# EAGLE design ble113_shield (EAGLE 7.2.0)
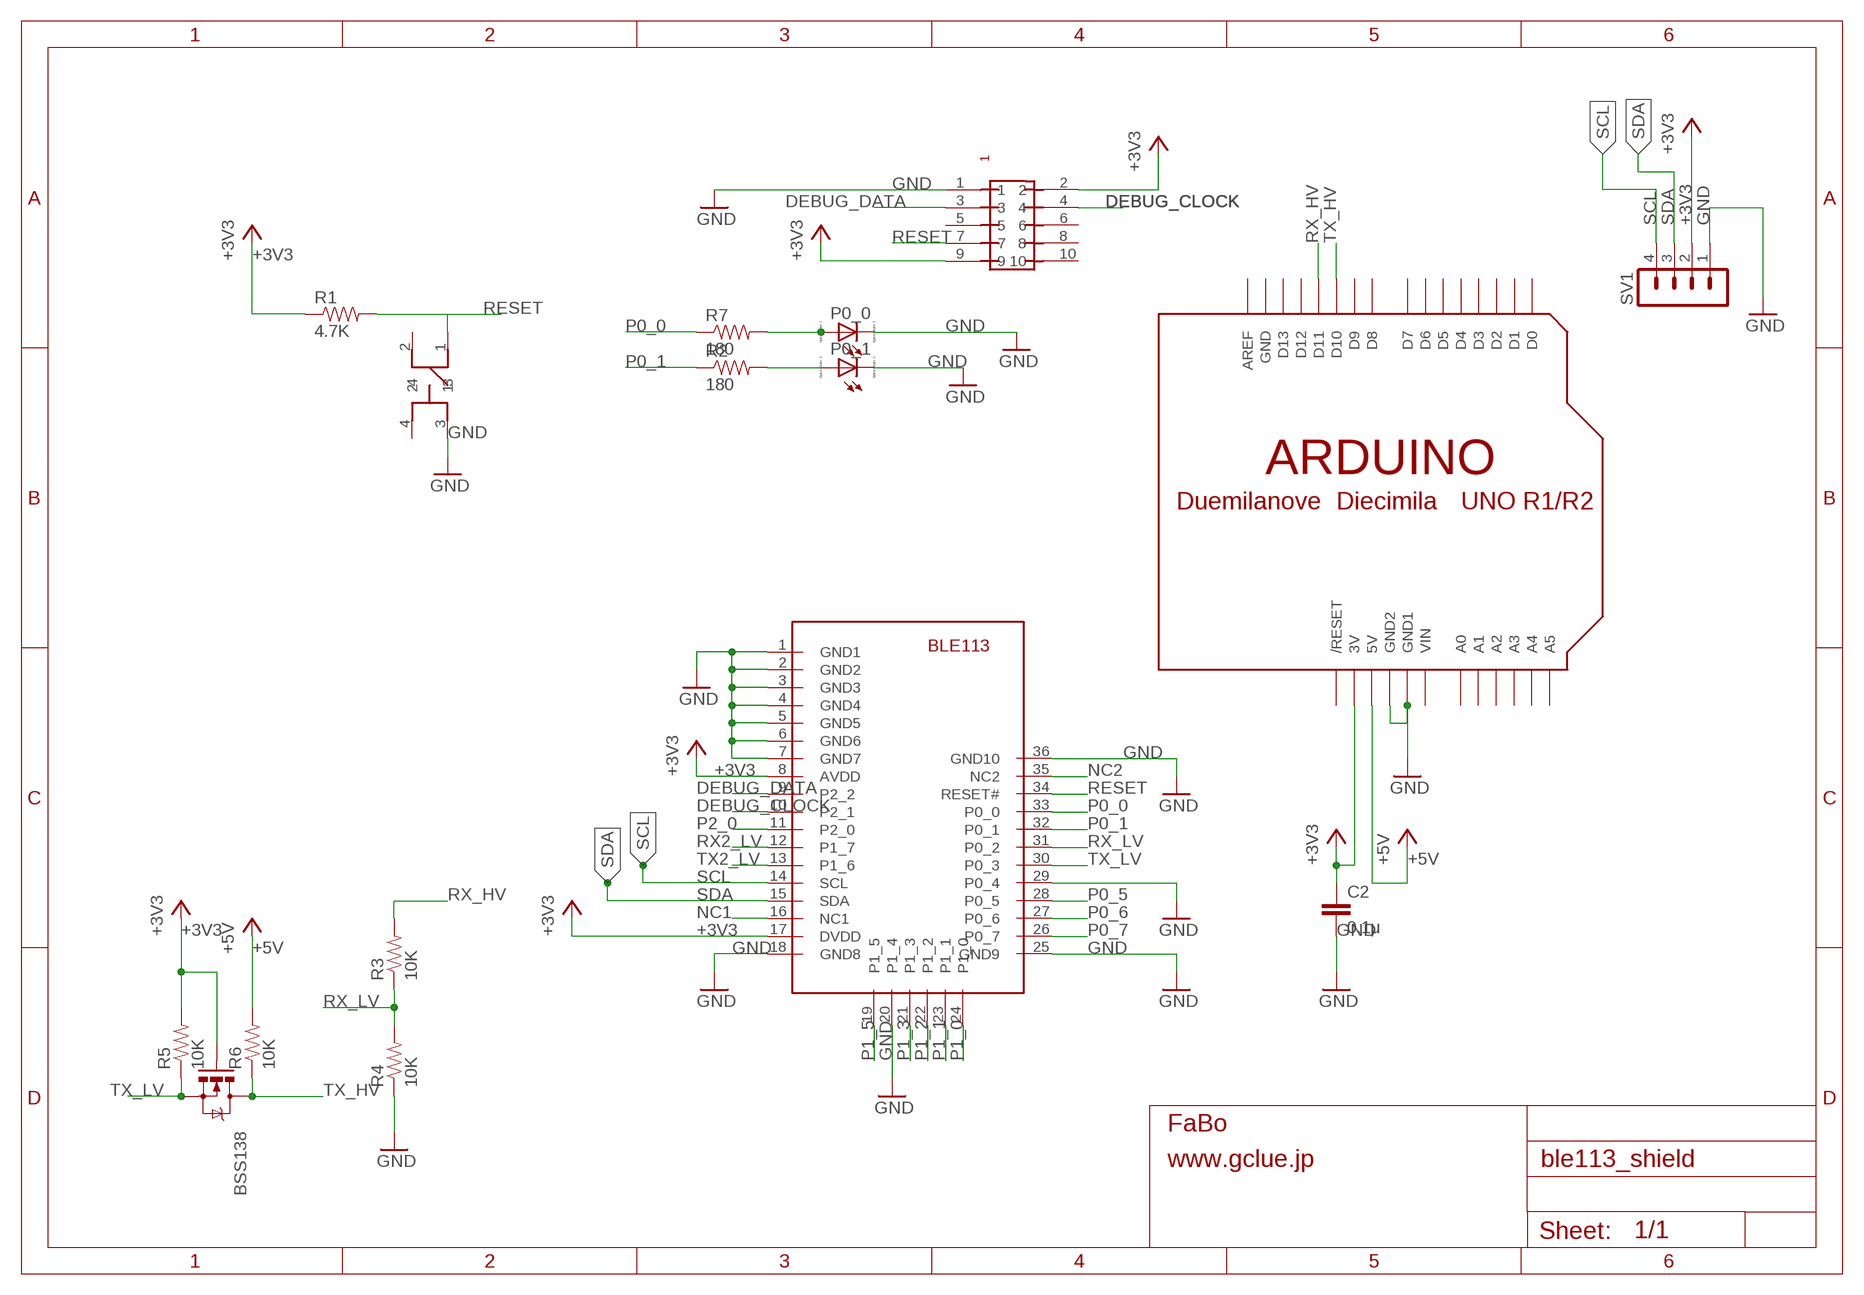
[diagram p0: schematic, sheet 1]

## Parts
BSS138  MOSFET-NCHANNELSMD  [SOT23-3]
C2  0.1μ  CAP0603-CAP  [0603-CAP]
P0_0  LED_ESML0603  [LED_SML0603]
P0_1  LED_ESML0603  [LED_SML0603]
R1  4.7K  RESISTOR0603-RES  [0603-RES]
R2  180  RESISTOR0603-RES  [0603-RES]
R3  10K  RESISTOR0603-RES  [0603-RES]
R4  10K  RESISTOR0603-RES  [0603-RES]
R5  10K  RESISTOR0603-RES  [0603-RES]
R6  10K  RESISTOR0603-RES  [0603-RES]
R7  180  RESISTOR0603-RES  [0603-RES]
SV1  MA04-1  [MA04-1]
U$1  PIN-HEADER-SMT(1.27MM)2X5  [PIN-HEADER-SMT(1.27MM)2X5]
U$4  SWITCH-LS6J2M-T  [SWICTH-LS6J2M-T]
U$6  BLUEGIGA-BLE113  [BLUEGIGA-BLE113]
U$7  ARDUINOUNO  [ARDUINO]

## Nets
+3V3: BSS138.1(G) C2.1 R1.1 R5.2 SV1.2 U$1.2 U$1.9 U$6.8(AVDD) U$6.17(DVDD) U$7.3V
+5V: R6.2 U$7.5V
DEBUG_CLOCK: U$1.4 U$6.10(P2_1)
DEBUG_DATA: U$1.3 U$6.9(P2_2)
GND: C2.2 P0_0.C P0_1.C R4.1 SV1.1 U$1.1 U$4.3 U$6.1(GND1) U$6.2(GND2) U$6.3(GND3) U$6.4(GND4) U$6.5(GND5) U$6.6(GND6) U$6.7(GND7) U$6.18(GND8) U$6.20(P1_4) U$6.25(GND9) U$6.29(P0_4) U$6.36(GND10) U$7.GND1 U$7.GND2
N$1: P0_0.A R7.2
N$2: P0_1.A R2.2
NC1: U$6.16(NC1)
NC2: U$6.35(NC2)
P0_0: R7.1 U$6.33(P0_0)
P0_1: R2.1 U$6.32(P0_1)
P0_5: U$6.28(P0_5)
P0_6: U$6.27(P0_6)
P0_7: U$6.26(P0_7)
P1_0: U$6.24(P1_0)
P1_1: U$6.23(P1_1)
P1_2: U$6.22(P1_2)
P1_3: U$6.21(P1_3)
P1_5: U$6.19(P1_5)
P2_0: U$6.11(P2_0)
RESET: R1.2 U$1.7 U$4.1 U$6.34(RESET#)
RX2_LV: U$6.12(P1_7)
RX_HV: R3.2 U$7.D11
RX_LV: R3.1 R4.2 U$6.31(P0_2)
SCL: SV1.4 U$6.14(SCL)
SDA: SV1.3 U$6.15(SDA)
TX2_LV: U$6.13(P1_6)
TX_HV: BSS138.3(D) R6.1 U$7.D10
TX_LV: BSS138.2(S) R5.1 U$6.30(P0_3)
Unconnected: U$1.5 U$1.6 U$1.8 U$1.10 U$4.2 U$4.4 U$7.A0 U$7.A1 U$7.A2 U$7.A3 U$7.A4 U$7.A5 U$7.AREF U$7.D0 U$7.D1 U$7.D2 U$7.D3 U$7.D4 U$7.D5 U$7.D6 U$7.D7 U$7.D8 U$7.D9 U$7.D12 U$7.D13 U$7.RESET(/RESET)

## Power pins joined to a net without a drawn wire
GND: U$7.GND
VIN: U$7.VIN

## Library data of the parts
BSS138 = SparkFun:MOSFET-NCHANNEL
C2 = SparkFun:CAP: Capacitor Standard 0603 ceramic capacitor, and 0.1" leaded capacitor.
P0_0 P0_1 = eagle-ltspice:LED_E: LED Source: http://www.osram.convergy.de Source: www.luxeon.com Source: www.kingbright.com; SPICEMODEL: NONE; SPICEPREFIX: D; SPICETYPE: diode
R1-R7 = SparkFun:RESISTOR: Resistor Basic schematic elements and footprints for 0603, 1206, and PTH resistors.
SV1 = con-lstb:MA04-1: PIN HEADER; OC_FARNELL: unknown; OC_NEWARK: unknown
U$1 = gclue:PIN-HEADER-SMT(1.27MM)2X5: PIN-HEADER-SMT (1.27MM) 2x5
U$4 = gclue:SWITCH-LS6J2M-T
U$6 = gclueBT:BLUEGIGA-BLE113: Bluegiga BLE113 Bluetooth Bluetooth 4.0 low energy radio Radio Transmit power: +0 dBm Receiver sensitivity: -93 dBm Typical line-of-sight range: 30 - 100 meters Current Consumption TX peak current: 18.2 mA, 14.3 ma (with DC/DC) RX peak current: 17.9 mA Power mode 1: 270 uA Power mode 2: 1 uA Power mode 3: 0.4 uA Certifications Japan: MIC Japan( 007-AB0103)
U$7 = adafruit:ARDUINO: Arduino Diecimila/Duemilanove Make a shield with ease, this package has all the named pins as well as the two mounting drill holes and an outline of the USB and DC power connector. The outline is on the DIMENSION layer, so if your board house uses it they will cut the outline to match. http://www.ladyada.net/library/pcb/eaglelibrary.html

## Board
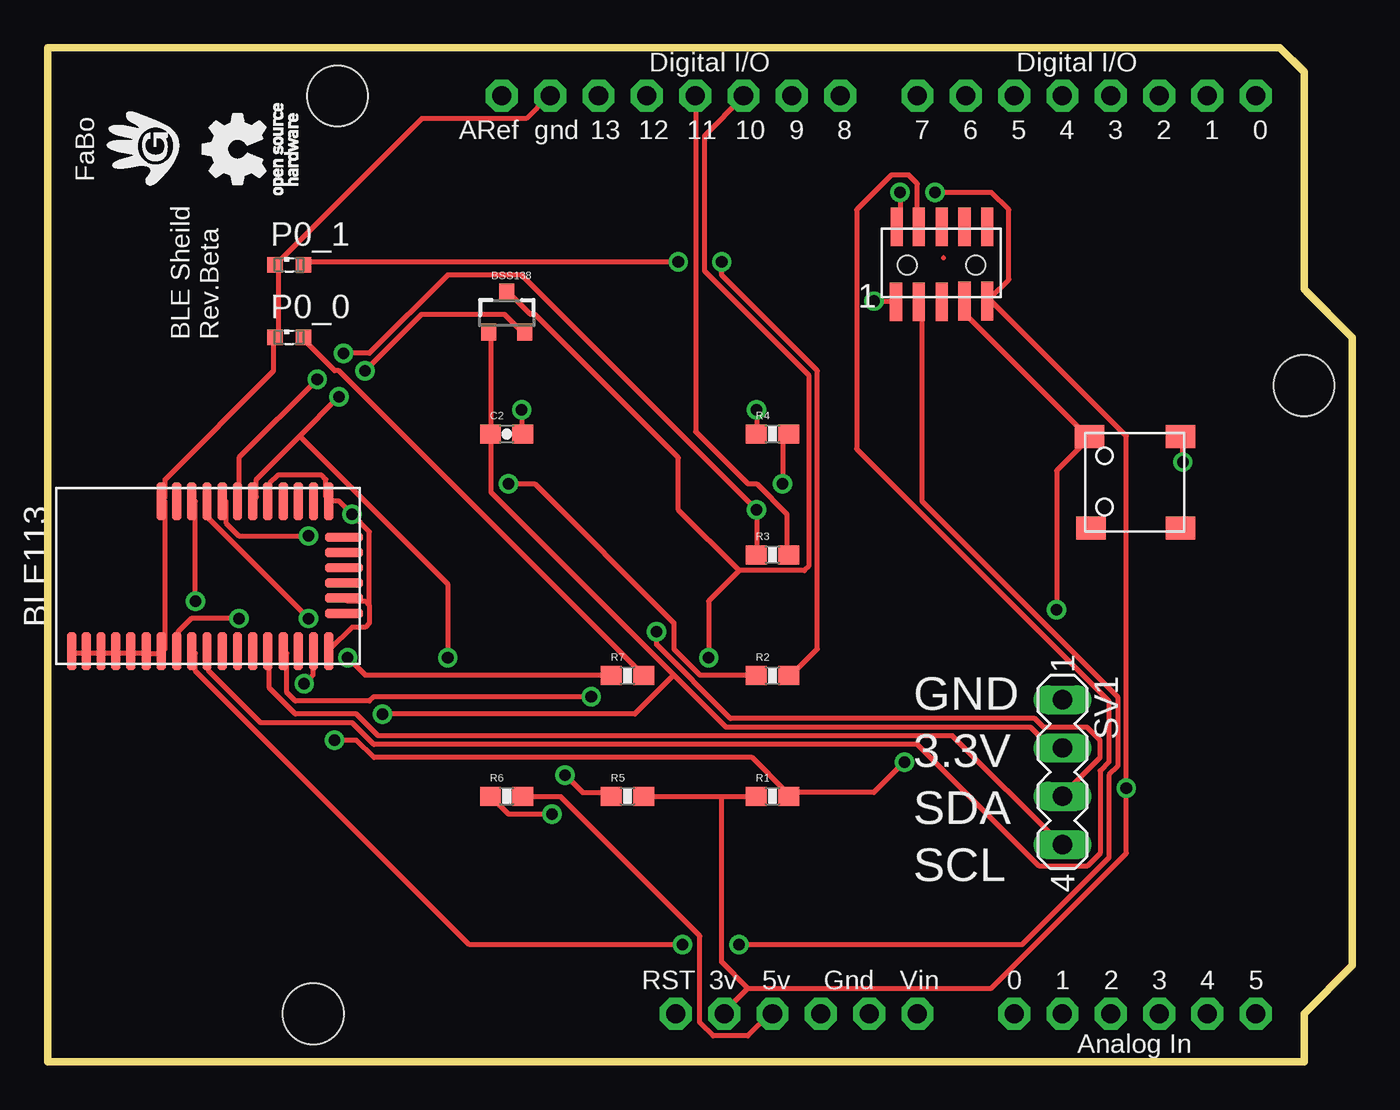
[diagram p1: board, top side]
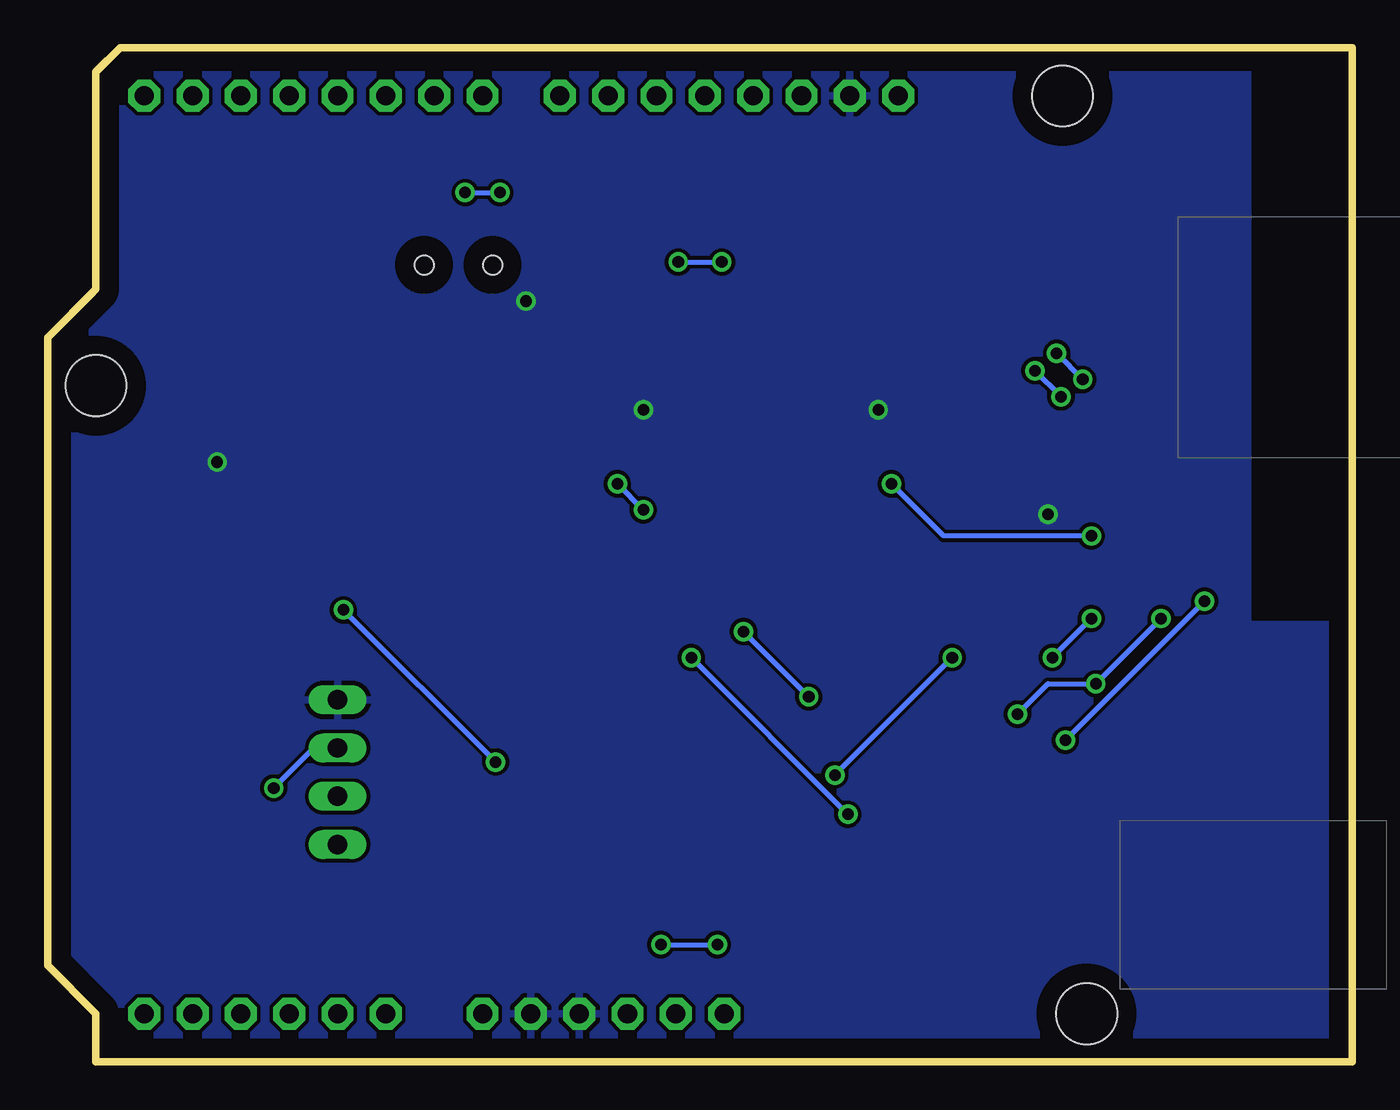
[diagram p2: board, bottom side, seen from below]

Size 68.58 x 53.34 mm. Coordinates in mm from the lower left corner, seen from the top.
Outline: 0,0 66.04,0 66.04,2.54 68.58,5.08 68.58,38.1 66.04,40.64 66.04,52.07 64.77,53.34 0,53.34 0,0
Copper layers (1*16): Top 0.035mm / dielectric 1.5mm / Bottom 0.035mm
Design rules "default": minimum track width 10mil, minimum drill 24mil, track to track 8mil, track to pad 8mil, pad to pad 8mil, via to via 8mil, smd to smd 8mil, copper to edge 40mil, drill to drill 8mil, minimum pad ring 10mil, minimum via ring 8mil, stop-mask expansion 4mil, vias tented up to drill 0mil, thermal gap 10mil
tKeepout: area 0,23 to 5.5,53.3
bKeepout: area 0,23 to 5.5,53.5

### Footprints (pad centres in the part's own frame; a part is rotated, then mirrored left to right if it is on the bottom)
SOT23-3 = smd 0.8 x 0.9: 1 -0.95,-1; 2 0.95,-1; 3 0,1.1
0603-CAP = smd 1.1 x 1: 1 -0.85,0; 2 0.85,0
LED_SML0603 = smd 0.8 x 0.8: A 0.75,0; C -0.75,0
0603-RES = smd 1.1 x 1: 1 -0.85,0; 2 0.85,0
MA04-1 = drill 1.016 long: 1 -3.81,0; 2 -1.27,0; 3 1.27,0; 4 3.81,0
PIN-HEADER-SMT(1.27MM)2X5 = smd 0.635 x 2.032: 1 -2.4,-1.95; 2 -2.35,2; 3 -1.2,-1.95; 4 -1.2,2; 5 0,-1.95; 6 0,2; 7 1.2,-1.9; 8 1.2,2; 9 2.4,-1.9; 10 2.4,2 | hole 1: 1.8,0; -1.8,0
SWICTH-LS6J2M-T = smd 1.55 x 1.2: 1 -2.4,2.4; 2 -2.3,-2.4; 3 2.4,2.4; 4 2.4,-2.4
BLUEGIGA-BLE113 = smd 2 x 0.5: 1 -3.81,6.35; 2 -3.81,5.58; 3 -3.81,4.81; 4 -3.81,4.04; 5 -3.81,3.24; 6 -3.81,2.44; 7 -3.81,1.64; 8 -3.81,0.84; 9 -3.81,0.04; 10 -3.81,-0.76; 11 -3.81,-1.56; 12 -3.81,-2.36; 13 -3.81,-3.16; 14 -3.81,-3.96; 15 -3.81,-4.76; 16 -3.81,-5.56; 17 -3.81,-6.36; 18 -3.81,-7.16; 25 4.09,-7.16; 26 4.09,-6.36; 27 4.09,-5.56; 28 4.09,-4.76; 29 4.09,-3.96; 30 4.09,-3.16; 31 4.09,-2.36; 32 4.09,-1.56; 33 4.09,-0.76; 34 4.09,0.04; 35 4.09,0.84; 36 4.09,1.64 | smd 0.5 x 2: 19 -1.81,-7.96; 20 -1.01,-7.96; 21 -0.21,-7.96; 22 0.59,-7.96; 23 1.39,-7.96; 24 2.19,-7.96
ARDUINO = drill 1 pad 1.676 octagon: 3V 35.56,2.54; 5V 38.1,2.54; A0 50.8,2.54; A1 53.34,2.54; A2 55.88,2.54; A3 58.42,2.54; A4 60.96,2.54; A5 63.5,2.54; AREF 23.876,50.8; D0 63.5,50.8; D1 60.96,50.8; D2 58.42,50.8; D3 55.88,50.8; D4 53.34,50.8; D5 50.8,50.8; D6 48.26,50.8; D7 45.72,50.8; D8 41.656,50.8; D9 39.116,50.8; D10 36.576,50.8; D11 34.036,50.8; D12 31.496,50.8; D13 28.956,50.8; GND 26.416,50.8; GND1 43.18,2.54; GND2 40.64,2.54; RESET 33.02,2.54; VIN 45.72,2.54 | hole 3.2: 15.24,50.8; 66.04,35.56; 13.97,2.54

### Placement (x,y rotation side)
BSS138  24.13,39.37 0 top
C2  24.13,33.02 0 top
P0_0  12.7,38.1 0 top
P0_1  12.7,41.91 0 top
R1  38.1,13.97 0 top
R2  38.1,20.32 0 top
R3  38.1,26.67 0 top
R4  38.1,33.02 0 top
R5  30.48,13.97 0 top
R6  24.13,13.97 0 top
R7  30.48,20.32 0 top
SV1  53.34,15.24 270 top
U$1  46.99,41.91 0 top
U$2  [LOGO_FABO_M]  5,48 90 top
U$3  [LOGO_OSHW_T_M]  10,48 90 top
U$4  57.15,30.48 0 top
U$6  7.62,25.4 90 top
U$7  0,0 0 top

### Tracks (layer width: path | path; a pad name or v marks a point on that pad's centre or on a via)
+3V3  (via drill 0.61)
  Top 0.254: 35.43,13.95 37.03,13.95 R1.1 | 35.43,13.95 31.55,13.95 R5.2 | 36.8,3.89 49.61,3.89 56.69,10.97 v56.69,14.4 56.69,32.92 49.61,40.01 U$1.9 49.61,40.23 50.52,41.15 50.52,44.81 49.61,45.72 v46.63,45.72 | 36.8,3.89 35.66,2.74 U$7.3V | v44.81,45.72 44.81,44.12 U$1.2 | 35.43,13.95 35.43,5.26 36.8,3.89 | v10.06,23.32 7.54,23.32 6.86,22.63 6.86,21.72 U$6.8 | v13.49,19.89 13.95,20.34 13.95,21.49 U$6.17 | BSS138.1 23.32,38.18 23.32,33.15 C2.1 23.32,32.92 23.32,29.95 32.92,20.34 | 32.92,20.34 35.66,17.6 51.66,17.6 52.58,16.69 53.26,16.69 SV1.2 | v17.6,18.29 30.86,18.29 32.92,20.34
  Bottom 0.254: v46.63,45.72 v44.81,45.72 | v10.06,23.32 v13.49,19.89 16,19.89 v17.6,18.29 | v56.69,14.4 54.63,16.46 53.49,16.46 SV1.2
+5V
  Top 0.254: R6.2 25.15,13.95 26.98,13.95 34.29,6.63 34.29,2.06 34.98,1.37 36.8,1.37 37.95,2.52 U$7.5V
AGND
  Top 0.254: 47.09,42.29
DEBUG_CLOCK
  Top 0.254: U$6.10 8.46,21.49 8.46,20.57 11.2,17.83 16,17.83 17.14,16.69 45.72,16.69 52.12,10.29 54.63,10.29 55.32,10.97 55.32,15.32 55.78,15.77 55.78,18.97 42.52,32.23 42.52,44.81 44.35,46.63 45.26,46.63 45.72,46.18 45.72,44.12 U$1.4
DEBUG_DATA  (via drill 0.61)
  Top 0.254: v33.38,6.17 22.17,6.17 7.77,20.57 7.77,21.49 U$6.9 | v36.35,6.17 51.21,6.17 55.78,10.74 55.78,15.09 56.24,15.54 56.24,19.2 45.95,29.49 45.95,39.78 U$1.3
  Bottom 0.254: v36.35,6.17 v33.38,6.17
GND  (via drill 0.61)
  Top 0.254: U$6.1 1.37,21.49 1.83,21.49 U$6.2 2.06,21.49 2.74,21.49 U$6.3 2.97,21.49 3.43,21.49 U$6.4 3.66,21.49 4.34,21.49 U$6.5 4.57,21.49 5.03,21.49 U$6.6 5.26,21.49 5.94,21.49 U$6.7 6.17,21.72 6.17,29.49 U$6.36 6.17,29.72 6.17,30.63 11.89,36.35 11.89,37.95 P0_0.C 12.12,38.18 12.12,41.83 P0_1.C 12.12,42.06 19.66,49.61 25.15,49.61 26.29,50.75 U$7.GND | U$6.29 11.66,29.72 11.66,30.4 12.12,30.86 14.4,30.86 14.63,30.63 14.63,29.72 U$6.25 14.86,29.49 15.32,29.49 v16,28.8 16.92,27.89 16.92,24 | 16.92,24 16.92,23.09 16.69,22.86 16,22.86 14.86,21.72 U$6.18 | 16.92,24 16.69,24.23 15.77,24.23 U$6.20 | v24.92,34.29 24.92,33.15 C2.2 | v37.26,34.29 37.26,33.15 R4.1 | v59.66,31.55 59.66,32.69 U$4.3 | v43.43,40.01 44.58,40.01 U$1.1
  pour Bottom: 5.5,54.5 5.5,23 -1,23 -1,-1 69,-1 69,54.5
N$1
  Top 0.254: P0_0.A 13.49,37.95 15.09,36.35 15.32,36.35 31.32,20.34 R7.2
N$2  (via drill 0.61)
  Top 0.254: v33.15,42.06 13.49,42.06 P0_1.A | v35.43,42.06 35.43,41.38 40.46,36.35 40.46,21.72 39.09,20.34 R2.2
  Bottom 0.254: v35.43,42.06 v33.15,42.06
P0_0  (via drill 0.61)
  Top 0.254: v15.77,21.26 16.69,20.34 29.49,20.34 R7.1 | v13.72,23.32 8.46,28.57 8.46,29.49 U$6.33
  Bottom 0.254: v13.72,23.32 v15.77,21.26
P0_1  (via drill 0.61)
  Top 0.254: v24.23,30.4 25.6,30.4 32.92,23.09 32.92,21.72 34.29,20.34 37.03,20.34 R2.1 | v13.72,27.66 10.06,27.66 9.37,28.35 9.37,29.49 U$6.32
  Bottom 0.254: v24.23,30.4 21.49,27.66 v13.72,27.66
RESET  (via drill 0.61)
  Top 0.254: v45.03,15.77 43.43,14.17 39.09,14.17 R1.2 38.86,14.17 37.03,16 17.14,16 16.23,16.92 v15.09,16.92 | v53.03,23.77 53.03,31.09 54.63,32.69 U$4.1 54.63,32.92 48.23,39.32 48.23,40.01 U$1.7 | v7.77,24.23 7.77,29.49 U$6.34
  Bottom 0.254: v53.03,23.77 v45.03,15.77 | v15.09,16.92 v7.77,24.23
RX_HV
  Top 0.254: R3.2 38.86,26.75 38.86,28.8 37.26,30.4 36.8,30.4 34.06,33.15 34.06,50.75 U$7.D11
RX_LV  (via drill 0.61)
  Top 0.254: v38.63,30.4 38.63,32.69 38.86,32.92 R4.2 | R3.1 37.26,26.75 v37.26,29.03 24.92,41.38 21.03,41.38 16.92,37.26 v15.54,37.26 | v14.17,35.89 10.06,31.77 10.06,29.72 U$6.31
  Bottom 0.254: v38.63,30.4 v37.26,29.03 | v15.54,37.26 v14.17,35.89
SCL
  Top 0.254: U$6.14 11.66,21.49 11.66,19.66 13.03,18.29 16.23,18.29 17.37,17.14 47.55,17.14 53.26,11.43 SV1.4
SDA  (via drill 0.61)
  Top 0.254: v28.57,19.2 17.14,19.2 16.92,18.97 13.03,18.97 12.57,19.43 12.57,21.49 U$6.15 | v32,22.63 32,21.95 35.89,18.06 51.89,18.06 52.35,17.6 54.63,17.6 55.32,16.92 55.32,16 53.49,14.17 SV1.3
  Bottom 0.254: v32,22.63 v28.57,19.2
TX_HV  (via drill 0.61)
  Top 0.254: 36.35,25.83 33.15,29.03 33.15,31.77 25.6,39.32 25.38,39.32 24.23,40.46 BSS138.3 | 36.35,25.83 39.78,25.83 40.01,26.06 40.01,36.12 34.52,41.6 34.52,48.69 36.58,50.75 U$7.D10 | v26.52,13.03 24.23,13.03 23.32,13.95 R6.1 | v34.75,21.26 34.75,24.23 36.35,25.83
  Bottom 0.254: v34.75,21.26 v26.52,13.03
TX_LV  (via drill 0.61)
  Top 0.254: v16.69,36.35 19.66,39.32 24,39.32 24.92,38.41 BSS138.2 | 13.26,32.92 10.97,30.63 10.97,29.72 U$6.30 | 13.26,32.92 v15.32,34.98 | v27.2,15.09 28.12,14.17 29.49,14.17 R5.1 | v21.03,21.26 21.03,25.15 13.26,32.92
  Bottom 0.254: v15.32,34.98 v16.69,36.35 | v21.03,21.26 v27.2,15.09

### Text on the board
tPlace: BLE Sheild / Rev.Beta | GND | 3.3V | SDA | SCL